# EAGLE design MiPolicia-Ethernet (EAGLE 9.1.3)
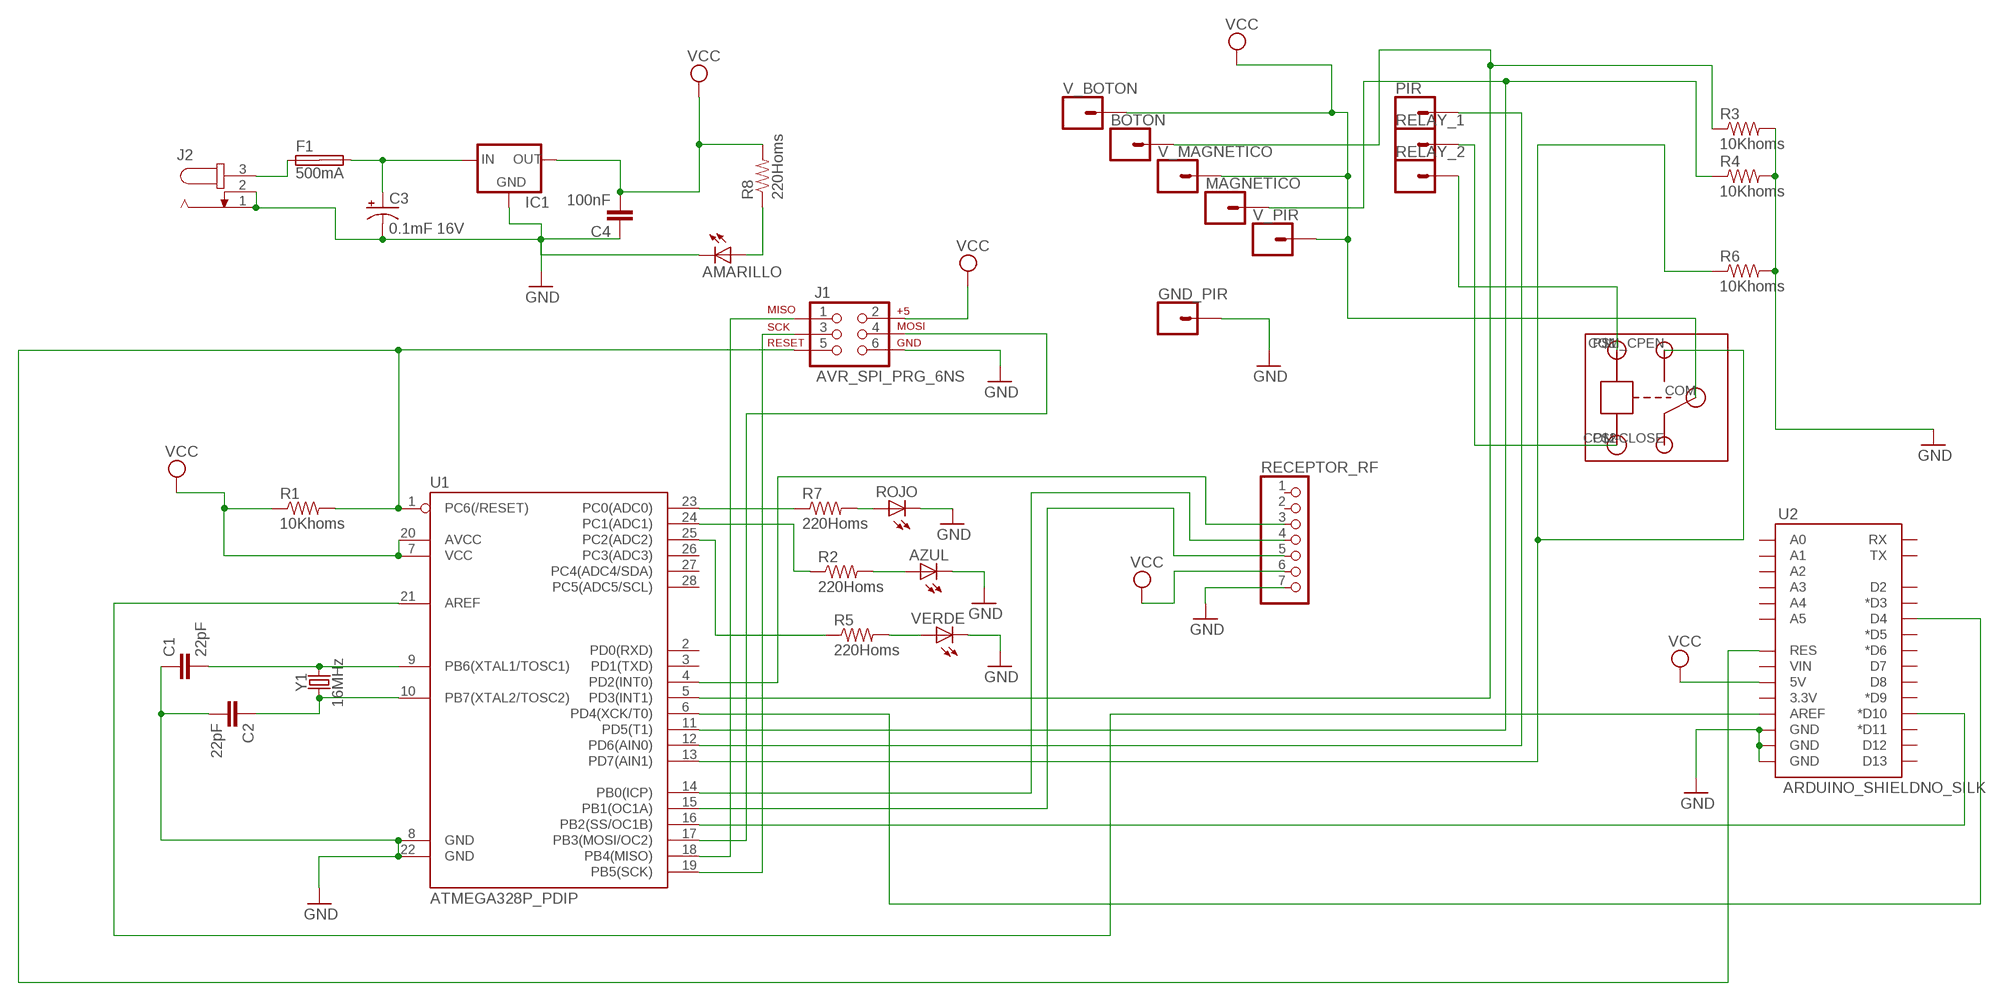
[diagram p0: schematic, sheet 1]

## Parts
AMARILLO  LED5MM  [LED5MM]
AZUL  LED5MM  [LED5MM]
BOTON  CONN_01  [1X01]
C1  22pF  22PF-PTH-2.54MM-200V-5%  [CAP-PTH-2.54]
C2  22pF  22PF-PTH-2.54MM-200V-5%  [CAP-PTH-2.54]
C3  0.1mF 16V  10UF-POLAR-RADIAL-2.5MM-KIT-25V-20%  [CPOL-RADIAL-2.5MM-5MM-KIT]
C4  100nF  22PF-PTH-2.54MM-200V-5%  [CAP-PTH-2.54]
F1  500mA  SHK20L  [SHK20L]
GND_PIR  CONN_01  [1X01]
IC1  V_REG_78XXSINK  [TO220-IGO]
J1  AVR_SPI_PRG_6NS  [2X3-NS]
J2  JACK-PLUG0  [SPC4077]
MAGNETICO  CONN_01  [1X01]
PIR  CONN_01  [1X01]
R1  10Khoms  RESISTORPTH-1/4W  [AXIAL-0.4]
R2  220Homs  RESISTORPTH-1/4W  [AXIAL-0.4]
R3  10Khoms  RESISTORPTH-1/4W  [AXIAL-0.4]
R4  10Khoms  RESISTORPTH-1/4W  [AXIAL-0.4]
R5  220Homs  RESISTORPTH-1/4W  [AXIAL-0.4]
R6  10Khoms  RESISTORPTH-1/4W  [AXIAL-0.4]
R7  220Homs  RESISTORPTH-1/4W  [AXIAL-0.4]
R8  220Homs  RESISTORPTH-1/4W  [AXIAL-0.4]
RECEPTOR_RF  PINHD-1X7  [1X07]
RELAY_1  CONN_01  [1X01]
RELAY_2  CONN_01  [1X01]
ROJO  LED5MM  [LED5MM]
U1  ATMEGA328P_PDIP  [DIL28-3]
U2  ARDUINO_SHIELDNO_SILK  [DUEMILANOVE_VIAS]
U$1  RELAY  [RELAY]
V_BOTON  CONN_01  [1X01]
V_MAGNETICO  CONN_01  [1X01]
V_PIR  CONN_01  [1X01]
VERDE  LED5MM  [LED5MM]
Y1  16MHz  CRYSTAL-16MHZPTH-HC49US  [HC49US]

## Nets
GND: AMARILLO.K(C) AZUL.K(C) C1.1 C2.2 C3.2(-) C4.1 GND_PIR.1 IC1.GND J1.6 J2.1 J2.2 R3.P$2 R4.P$2 R6.P$2 RECEPTOR_RF.7 ROJO.K(C) U1.8(GND) U1.22(GND) U2.GND@0(GND) U2.GND@1(GND) U2.GND@2(GND) VERDE.K(C)
N$1: J1.5 R1.P$2 U1.1(PC6(/RESET)) U2.RES
N$2: R2.P$1 U1.24(PC1(ADC1))
N$3: F1.1A J2.3
N$4: C1.2 U1.9(PB6(XTAL1/TOSC1)) Y1.2
N$5: C2.1 U1.10(PB7(XTAL2/TOSC2)) Y1.1
N$6: AZUL.A R2.P$2
N$7: U1.6(PD4(XCK/T0)) U2.D4
N$8: U1.16(PB2(SS/OC1B)) U2.D10(*D10)
N$9: U1.21(AREF) U2.AREF
N$10: J1.4 U1.17(PB3(MOSI/OC2))
N$11: J1.1 U1.18(PB4(MISO))
N$12: J1.3 U1.19(PB5(SCK))
N$13: MAGNETICO.1 R4.P$1 U1.11(PD5(T1))
N$14: BOTON.1 R3.P$1 U1.5(PD3(INT1))
N$15: PIR.1 U1.12(PD6(AIN0))
N$16: R5.P$1 U1.25(PC2(ADC2))
N$17: RECEPTOR_RF.4 U1.14(PB0(ICP))
N$18: AMARILLO.A R8.P$1
N$19: RECEPTOR_RF.5 U1.15(PB1(OC1A))
N$20: C3.1(+) F1.2A IC1.IN
N$21: RECEPTOR_RF.3 U1.4(PD2(INT0))
N$22: R7.P$1 U1.23(PC0(ADC0))
N$23: R7.P$2 ROJO.A
N$24: RELAY_2.1 U$1.P$1(IN)
N$25: RELAY_1.1 U$1.P$2(GND)
N$26: R6.P$1 U1.13(PD7(AIN1)) U$1.COM_CPEN(COM-OPEN)
N$27: R5.P$2 VERDE.A
VCC: C4.2 IC1.OUT J1.2 R1.P$1 R8.P$2 RECEPTOR_RF.6 U1.7(VCC) U1.20(AVCC) U2.5V U$1.COM V_BOTON.1 V_MAGNETICO.1 V_PIR.1
Unconnected: F1.1B F1.2B RECEPTOR_RF.1 RECEPTOR_RF.2 U1.2(PD0(RXD)) U1.3(PD1(TXD)) U1.26(PC3(ADC3)) U1.27(PC4(ADC4/SDA)) U1.28(PC5(ADC5/SCL)) U2.3.3V U2.A0 U2.A1 U2.A2 U2.A3 U2.A4 U2.A5 U2.D2 U2.D3(*D3) U2.D5(*D5) U2.D6(*D6) U2.D7 U2.D8 U2.D9(*D9) U2.D11(*D11) U2.D12 U2.D13 U2.RX U2.TX U2.VIN U$1.COM-CLOSE

## Library data of the parts
AMARILLO AZUL ROJO VERDE = SparkFun-LED:LED: LEDs Standard schematic elements and footprints for 5mm, 3mm, 1206, and 0603 sized LEDs. 5mm - Spark Fun Electronics SKU : COM-00529 (and others)
BOTON GND_PIR MAGNETICO PIR RELAY_1 RELAY_2 V_BOTON V_MAGNETICO V_PIR = SparkFun-Connectors:CONN_01: Single connection point. Often used as Generic Header-pin footprint for 0.1 inch spaced/style header connections On any of the 0.1 inch spaced packages, you can populate with these: Break Away Headers - Straight <https://www.sparkfun.com/products/116> (PRT-00116) Break Away Male Headers - Right Angle <https://www.sparkfun.com/products/553> (PRT-00553) Female Headers <https://www.sparkfun.com/products/115> (PRT-00115) Break Away Headers - Machine Pin <https://www.sparkfun.com/products/117> (PRT-00117) Break Away Female Headers - Swiss Machine Pin <https://www.sparkfun.com/products/743> (PRT-00743) This device is also useful as a general connection point to wire up your design to another part of your project. Our various solder wires solder well into these plated through hole pads. Hook-Up Wire - Assortment (Stranded, 22 AWG) <https://www.sparkfun.com/products/11375> (PRT-11375) Hook-Up Wire - Assortment (Solid Core, 22 AWG) <https://www.sparkfun.com/products/11367> (PRT-11367) View the entire wire category on our website here <https://www.sparkfun.com/categories/141> Special notes: SMTSO-256-ET is a "flush mount" nut for a 4-40 screw. We mostly use this on specialty testbeds; it is a nice way to connect hardware to your PCB at an adjustable hieght. Also note, the SNAP packages are for using a snappable style connector. We sell a baggie of snaps and they are also used on two LilyPad designs: Snap Assortment - 30 pack (male and female) <https://www.sparkfun.com/products/11347> (DEV-11347) LilyPad Arduino SimpleSnap <https://www.sparkfun.com/products/10941> (DEV-10941) LilyPad SimpleSnap Protoboard <https://www.sparkfun.com/products/10940> (DEV-10940)
C1 C2 = SparkFun-Capacitors:22PF: 22pF ceramic capacitors A capacitor is a passive two-terminal electrical component used to store electrical energy temporarily in an electric field.; PROD_ID: CAP-09128
C3 = SparkFun-Capacitors:10UF-POLAR: 10.0µF polarized capacitors A capacitor is a passive two-terminal electrical component used to store electrical energy temporarily in an electric field.; PROD_ID: CAP-08440; VALUE: 10uF
C4 = SparkFun-Capacitors:22PF: 22pF ceramic capacitors A capacitor is a passive two-terminal electrical component used to store electrical energy temporarily in an electric field.; PROD_ID: CAP-09128; VALUE: 22pF
F1 = fuse:SHK20L: FUSE HOLDER 5 x 20 mm, SH contact, SHH1 Schukat, E1073 Buerklin; OC_FARNELL: unknown; OC_NEWARK: unknown
IC1 = SparkFun:V_REG_78XX: Voltage Regulator Standard 7805 5V regulator. IGO (Input Ground Output). Spark Fun Electronics SKU : COM-00107
J1 = SparkFun-Connectors:AVR_SPI_PRG_6: AVR ISP 6 Pin This is the reduced ISP connector for AVR programming. Common on Arduino. This footprint will take up less PCB space and can be used with a 10-pin to 6-pin adapter such as SKU: BOB-08508
J2 = con-jack:JACK-PLUG: DC POWER JACK Power Jack, DC, Right Angle, Through Hole, Rated 5A at 16VDC, PC Terminals Distributor: Farnell (www.Farnell.de) Drawing: 84N1161.pdf / 84N1162.pdf Manufacturer: SPC Technology (www.spctechnology.com) Type: SPC4077 / SPC 4078; OC_FARNELL: unknown; OC_NEWARK: unknown
R1-R8 = SparkFun-Resistors:RESISTOR: Resistor Basic schematic elements and footprints for 0603, 1206, and PTH resistors.
RECEPTOR_RF = pinhead:PINHD-1X7: PIN HEADER
U1 = SparkFun-DigitalIC:ATMEGA328P_PDIP: uC used in the Arduino 32kb flash, 1k EEPROM, 2k SRAM This is the through-hole version of this chip.
U2 = SparkFun-Boards:ARDUINO_SHIELD: Arduino shield footprint
U$1 = RELAY:RELAY
Y1 = SparkFun-Clocks:CRYSTAL-16MHZ: 16MHz Crystal Digikey Example <http://www.digikey.com/product-search/en?keywords=535-9122-1-ND> Frequency: 16MHz Frequency Stability: ±50ppm Frequency Tolerance: ±20ppm Load Capacitance: 18pF SparkFun Products: Pro Micro -5V/16MHz <https://www.sparkfun.com/products/12640> SparkFun Serial Enabled LCD Kit <https://www.sparkfun.com/products/10097>; PROD_ID: XTAL-08181; SF_ID: COM-00536

## Board
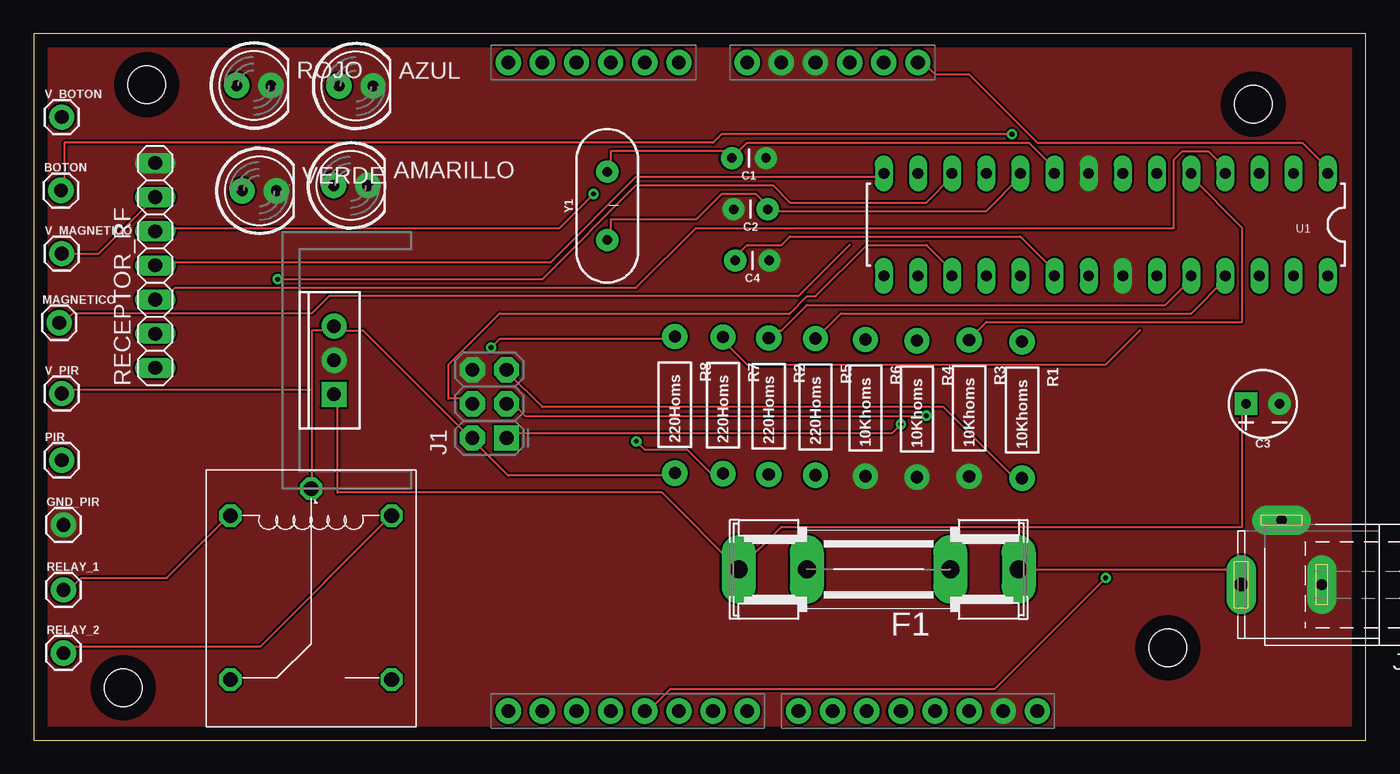
[diagram p1: board, top side]
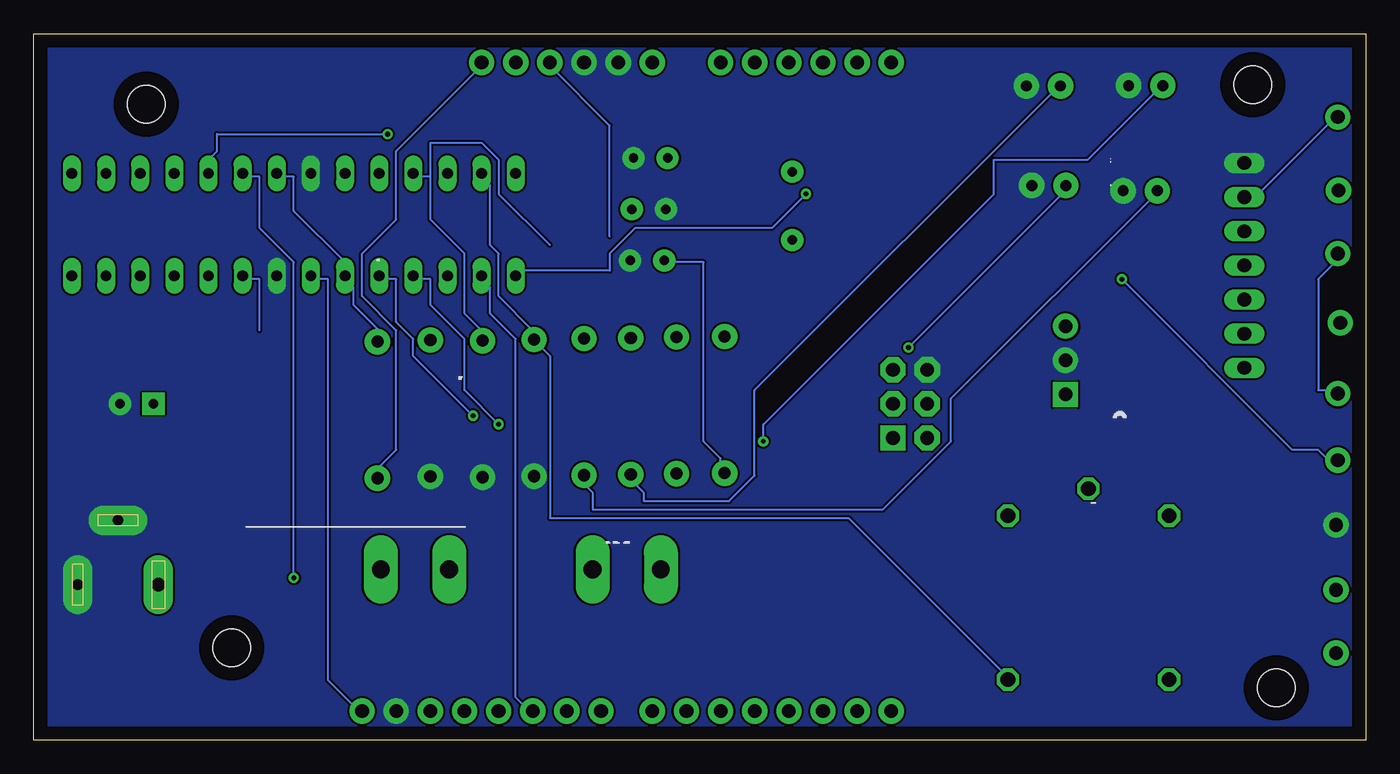
[diagram p2: board, bottom side, seen from below]

Size 99.11 x 52.57 mm. Coordinates in mm from the lower left corner, seen from the top.
Outline: 0,0 99.11,0 99.11,52.57 0,52.57 0,0
Copper layers (1*16): Top 0.035mm / dielectric 1.5mm / Bottom 0.035mm
Design rules "default": minimum track width 6mil, minimum drill 0.35mm, track to track 6mil, track to pad 6mil, pad to pad 6mil, via to via 6mil, smd to smd 6mil, copper to edge 40mil, drill to drill 6mil, minimum pad ring 10mil, minimum via ring 8mil, stop-mask expansion 4mil, vias tented up to drill 0mil, thermal gap 10mil
Holes 2.79 mm at 90.74,47.31 84.39,6.86 6.67,3.87 6.67,3.87 8.42,48.76

### Footprints (pad centres in the part's own frame; a part is rotated, then mirrored left to right if it is on the bottom)
LED5MM = drill 0.813 pad 1.88: A -1.27,0; K 1.27,0
1X01 = drill 1.016 pad 1.88: 1 0,0
CAP-PTH-2.54 = drill 0.7 pad 1.651: 1 -1.27,0; 2 1.27,0
CPOL-RADIAL-2.5MM-5MM-KIT = drill 0.7 pad 1.651 square: 1 1.25,0 | drill 0.7 pad 1.651: 2 -1.25,0
SHK20L = drill 1.321 pad 2.54 long: 1A -10.414,0; 1B -5.334,0; 2A 10.414,0; 2B 5.334,0
TO220-IGO = drill 1 pad 1.88: GND 0,0; OUT 2.54,0 | drill 1 pad 1.88 square: IN -2.54,0
2X3-NS = drill 1.016 pad 1.88 square: 1 -2.54,-1.27 | drill 1.016 pad 1.88 octagon: 2 -2.54,1.27; 3 0,-1.27; 4 0,1.27; 5 2.54,-1.27; 6 2.54,1.27
SPC4077 = drill 0.8 pad 2.184 long: 1 -3,0; 2 0,-4.8 | drill 1 pad 2.184 long: 3 3,0
AXIAL-0.4 = drill 0.9 pad 1.88: P$1 -5.08,0; P$2 5.08,0
1X07 = drill 1.016 long: 1 -7.62,0; 2 -5.08,0; 3 -2.54,0; 4 0,0; 5 2.54,0; 6 5.08,0; 7 7.62,0
DIL28-3 = drill 0.813 long: 1 -16.51,-3.81; 2 -13.97,-3.81; 3 -11.43,-3.81; 4 -8.89,-3.81; 5 -6.35,-3.81; 6 -3.81,-3.81; 7 -1.27,-3.81; 8 1.27,-3.81; 9 3.81,-3.81; 10 6.35,-3.81; 11 8.89,-3.81; 12 11.43,-3.81; 13 13.97,-3.81; 14 16.51,-3.81; 15 16.51,3.81; 16 13.97,3.81; 17 11.43,3.81; 18 8.89,3.81; 19 6.35,3.81; 20 3.81,3.81; 21 1.27,3.81; 22 -1.27,3.81; 23 -3.81,3.81; 24 -6.35,3.81; 25 -8.89,3.81; 26 -11.43,3.81; 27 -13.97,3.81; 28 -16.51,3.81
DUEMILANOVE_VIAS = drill 1.016 pad 1.88: 3.3V 50.8,13.97; 5V 50.8,16.51; A0 50.8,29.21; A1 50.8,31.75; A2 50.8,34.29; A3 50.8,36.83; A4 50.8,39.37; A5 50.8,41.91; AREF 2.54,2.54; D2 2.54,36.83; D3 2.54,34.29; D4 2.54,31.75; D5 2.54,29.21; D6 2.54,26.67; D7 2.54,24.13; D8 2.54,20.32; D9 2.54,17.78; D10 2.54,15.24; D11 2.54,12.7; D12 2.54,10.16; D13 2.54,7.62; GND@0 50.8,19.05; GND@1 50.8,21.59; GND@2 2.54,5.08; RES 50.8,11.43; RX 2.54,41.91; TX 2.54,39.37; VIN 50.8,24.13
RELAY = drill 1.1 octagon: COM -2,0; COM-CLOSE 12.2,-6; COM_CPEN 12.2,6; P$1 0,6; P$2 0,-6
HC49US = drill 0.7 pad 1.651: 1 -2.54,0; 2 2.54,0

### Placement (x,y rotation side)
AMARILLO  23.59,41.27 0 top
AZUL  23.99,48.67 0 top
BOTON  2.03,40.89 0 top
C1  53.21,43.31 180 top
C2  53.34,39.5 180 top
C3  91.44,25.02 180 top
C4  53.47,35.69 180 top
F1  62.86,12.7 180 top
GND_PIR  2.22,16 0 top
IC1  22.35,28.26 90 top
J1  33.91,25.02 90 top
J2  92.84,11.56 180 top
MAGNETICO  1.91,31.05 0 top
PIR  2.1,20.83 0 top
R1  73.53,24.56 270 top
R2  54.69,24.84 270 top
R3  69.6,24.69 270 top
R4  65.71,24.64 270 top
R5  58.17,24.79 270 top
R6  61.87,24.71 270 top
R7  51.28,24.9 270 top
R8  47.7,24.94 270 top
RECEPTOR_RF  9.04,35.32 90 top
RELAY_1  2.22,11.18 0 top
RELAY_2  2.22,6.48 0 top
ROJO  16.38,48.7 0 top
U1  79.76,38.35 180 top
U2  77.22,-0.38 90 top
U$1  20.64,16.7 270 top
V_BOTON  2.1,46.36 0 top
V_MAGNETICO  2.1,36.2 0 top
V_PIR  2.1,25.78 0 top
VERDE  16.79,40.87 0 top
Y1  42.67,39.75 90 top

### Tracks (layer width: path | path; a pad name or v marks a point on that pad's centre or on a via)
GND
  pour Top (no thermals): 0.06,52.51 99.12,52.51 99.12,52.32 99.12,-0.06 -0.06,-0.06 -0.06,0 -0.06,52.58 0.19,52.58
  pour Bottom (no thermals): 0.13,52.51 99.06,52.51 99.06,52.26 99.06,0.06 98.81,0.06 0.06,0.06 0.06,0.19 0.06,52.64 0.19,52.64
N$1
  Top 0.152: U1.1 96.27,42.55 94.36,44.45 74.68,44.45 69.6,49.53 67.06,49.53 66.42,50.17 65.79,50.17 U2.RES | J1.5 35.31,27.31 37.85,24.77 67.69,24.77 72.77,19.68 73.41,19.68 R1.P$2
  Bottom 0.152: U2.RES 65.79,50.17 72.14,43.81 72.14,38.73 74.68,36.2 74.68,33.02 72.14,30.48 72.14,21.59 73.41,20.32 73.41,19.68 R1.P$2
N$2
  Top 0.152: U1.24 86.11,34.29 84.2,32.39 57.53,32.39 55.63,30.48 54.99,30.48 R2.P$1
N$3
  Top 0.152: J2.3 89.28,12.07 88.65,12.7 73.41,12.7 F1.1A
N$4
  Top 0.152: U1.9 75.95,42.55 74.04,44.45 53.09,44.45 52.45,43.81 C1.2 51.82,43.81 42.93,43.81 42.93,42.55 Y1.2
N$5
  Top 0.152: U1.10 73.41,41.91 70.87,39.37 54.99,39.37 C2.1 54.36,40.01 53.72,40.64 51.18,40.64 49.28,38.73 42.93,38.73 42.93,37.47 Y1.1
N$6
  Bottom 0.152: AZUL.A 23.24,48.26 45.47,26.04 45.47,19.68 47.37,17.78 53.72,17.78 53.72,18.42 54.36,19.05 54.36,19.68 R2.P$2
N$7  (via drill 0.35)
  Top 0.152: v79.76,12.07 71.5,3.81 47.37,3.81 46.1,2.54 45.47,2.54 U2.D4
  Bottom 0.152: v79.76,12.07 79.76,35.56 82.3,38.1 82.3,41.91 83.57,41.91 U1.6
N$8
  Bottom 0.152: U1.16 65.79,34.29 65.15,33.66 65.15,31.75 63.25,29.85 63.25,3.18 61.98,1.91 U2.D10
N$9
  Bottom 0.152: U1.21 78.49,34.29 77.22,34.29 77.22,4.45 74.68,1.91 U2.AREF
N$10
  Top 0.152: U1.17 68.33,34.92 66.42,36.83 61.98,36.83 58.17,33.02 57.53,33.02 56.26,31.75 34.67,31.75 30.86,27.94 30.86,25.4 32.13,25.4 J1.4
N$11  (via drill 0.35)
  Top 0.152: v64.52,23.5 63.88,22.86 35.31,22.86 J1.1
  Bottom 0.152: v64.52,23.5 67.06,26.04 67.06,29.85 69.6,32.39 69.6,34.29 70.87,34.29 U1.18
N$12  (via drill 0.35)
  Top 0.152: v66.42,24.13 36.58,24.13 35.94,24.77 35.31,24.77 J1.3
  Bottom 0.152: v66.42,24.13 70.87,28.57 70.87,29.85 72.14,31.11 72.14,34.29 73.41,34.29 U1.19
N$13  (1 unrouted)
  Top 0.152: 60.71,36.83 56.9,33.02 21.97,33.02 20.7,31.75 2.92,31.75 2.29,31.11 MAGNETICO.1
  Bottom 0.152: 69.6,41.91 70.87,41.91 U1.11 | 69.6,41.91 69.6,38.73 67.06,36.2 67.06,31.75 65.79,30.48 65.79,29.85 R4.P$1 | 60.71,36.83 64.52,40.64 64.52,43.18 65.79,44.45 69.6,44.45 69.6,41.91
N$14  (via drill 0.35)
  Top 0.152: U1.5 86.11,41.91 89.92,38.1 89.92,31.11 70.87,31.11 69.6,29.85 R3.P$1 | v72.77,45.09 51.18,45.09 50.55,44.45 2.29,44.45 2.29,41.28 BOTON.1
  Bottom 0.152: v72.77,45.09 85.47,45.09 85.47,43.81 86.11,43.18 86.11,42.55 U1.5
N$15  (via drill 0.35)
  Top 0.152: v18.16,34.29 37.85,34.29 44.83,41.28 54.99,41.28 56.26,40.01 66.42,40.01 68.33,41.91 U1.12
  Bottom 0.152: v18.16,34.29 5.46,21.59 3.56,21.59 2.29,20.32 PIR.1
N$16
  Top 0.152: U1.25 88.65,34.29 86.11,31.75 60.07,31.75 58.8,30.48 58.17,30.48 R5.P$1
N$17
  Top 0.152: U1.14 63.25,41.91 44.83,41.91 38.48,35.56 9.27,35.56 RECEPTOR_RF.4
N$18  (via drill 0.35)
  Top 0.152: v34.04,29.21 34.67,29.85 47.37,29.85 R8.P$1
  Bottom 0.152: v34.04,29.21 22.61,40.64 AMARILLO.A
N$19  (via drill 0.35)
  Top 0.152: v41.66,40.64 39.12,38.1 9.27,38.1 RECEPTOR_RF.5
  Bottom 0.152: v41.66,40.64 44.2,38.1 54.36,38.1 56.26,36.2 56.26,34.92 63.25,34.92 U1.15
N$20
  Top 0.152: C3.1 89.92,24.77 89.92,15.88 55.63,15.88 F1.2A 46.74,18.42 22.61,18.42 22.61,25.4 IC1.IN
N$21
  Top 0.152: U1.4 88.65,42.55 87.38,43.81 85.47,43.81 84.84,43.18 84.84,38.1 49.28,38.1 44.83,33.66 10.54,33.66 9.91,33.02 9.27,33.02 RECEPTOR_RF.3
N$22  (1 unrouted)
  Top 0.152: 82.3,30.48 79.76,27.94 53.09,27.94 51.18,29.85 R7.P$1
  Bottom 0.152: 82.3,30.48 82.3,34.29 83.57,34.29 U1.23
N$23  (via drill 0.35)
  Top 0.152: v44.83,22.22 45.47,21.59 48.64,21.59 50.55,19.68 51.18,19.68 R7.P$2
  Bottom 0.152: v44.83,22.22 44.83,23.5 27.69,40.64 27.69,43.18 20.7,43.18 15.62,48.26 ROJO.A
N$24
  Top 0.152: U$1.P$1 26.42,16.51 16.89,6.98 2.29,6.98 RELAY_2.1
N$25
  Top 0.152: U$1.P$2 14.35,16.51 9.91,12.07 3.56,12.07 2.92,11.43 2.29,11.43 RELAY_1.1
N$26
  Bottom 0.152: U1.13 65.79,41.91 65.15,41.28 65.15,36.83 64.52,36.2 64.52,33.02 61.98,30.48 61.98,29.85 R6.P$1 61.34,29.21 60.71,28.57 60.71,16.51 38.48,16.51 27.05,5.08 U$1.COM_CPEN
N$27
  Bottom 0.152: VERDE.A 15.62,40.64 30.86,25.4 30.86,22.22 35.94,17.14 57.53,17.14 57.53,18.42 58.17,19.05 58.17,19.68 R5.P$2
VCC  (1 unrouted)
  Top 0.152: RECEPTOR_RF.6 8.64,40.01 4.83,36.2 2.29,36.2 V_MAGNETICO.1 | 20.7,26.04 20.7,30.48 21.97,30.48 IC1.OUT 22.61,30.48 24.51,30.48 32.13,22.86 J1.2 32.77,22.22 35.31,19.68 47.37,19.68 R8.P$2 | 20.7,26.04 20.7,19.05 U$1.COM | C4.2 52.45,36.2 53.09,36.83 55.63,36.83 56.26,37.47 73.41,37.47 75.95,34.92 U1.20 | 20.7,26.04 2.29,26.04 V_PIR.1
  Bottom 0.152: V_PIR.1 2.29,26.04 3.56,26.04 3.56,34.29 2.29,35.56 2.29,36.2 V_MAGNETICO.1 | V_BOTON.1 2.29,46.36 8.64,40.01 RECEPTOR_RF.6 | R1.P$1 73.41,29.85 73.41,30.48 75.31,32.39 75.31,33.66 75.95,34.29 U1.20 75.95,34.92 75.95,35.56 79.76,39.37 79.76,41.91 81.03,41.91 U1.7 | C4.2 51.82,35.56 49.28,35.56 49.28,22.22 48.01,20.96 48.01,20.32 R8.P$2 | 56.26,37.47 56.26,45.72 60.71,50.17 U2.5V